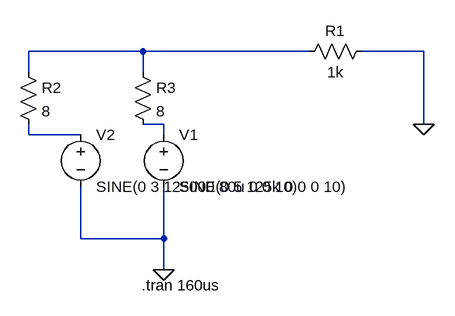
[diagram p0: schematic Sample Waveform.asc]
Sample Waveform.asc, the LTspice schematic file:
Version 4
SHEET 1 880 680
WIRE 80 -112 -96 -112
WIRE 336 -112 80 -112
WIRE 512 -112 416 -112
WIRE -96 -80 -96 -112
WIRE 80 -80 80 -112
WIRE 112 0 80 0
WIRE 512 0 512 -112
WIRE -96 16 -96 0
WIRE -16 16 -96 16
WIRE 112 16 112 0
WIRE -16 176 -16 96
WIRE 112 176 112 96
WIRE 112 176 -16 176
WIRE 112 224 112 176
FLAG 112 224 0
FLAG 512 0 0
SYMBOL voltage 112 0 R0
WINDOW 123 0 0 Left 2
WINDOW 39 0 0 Left 2
SYMATTR InstName V1
SYMATTR Value SINE(0 5 125k 0 0 0 10)
SYMBOL res 432 -128 R90
WINDOW 0 0 56 VBottom 2
WINDOW 3 32 56 VTop 2
SYMATTR InstName R1
SYMATTR Value 1k
SYMBOL voltage -16 0 R0
WINDOW 123 0 0 Left 2
WINDOW 39 0 0 Left 2
SYMATTR InstName V2
SYMATTR Value SINE(0 3 125000 80u 0 0 10)
SYMBOL res 64 -96 R0
SYMATTR InstName R3
SYMATTR Value 8
SYMBOL res -112 -96 R0
SYMATTR InstName R2
SYMATTR Value 8
TEXT 78 248 Left 2 !.tran 160us

The netlist it stands for:
* Sample Waveform.asc
V1 N002 0 SINE(0 5 125k 0 0 0 10)
R1 0 N001 1k
V2 N003 0 SINE(0 3 125000 80u 0 0 10)
R3 N001 N002 8
R2 N001 N003 8
.tran 160us
.backanno
.end